# EAGLE design pov_alt (EAGLE 5.11)
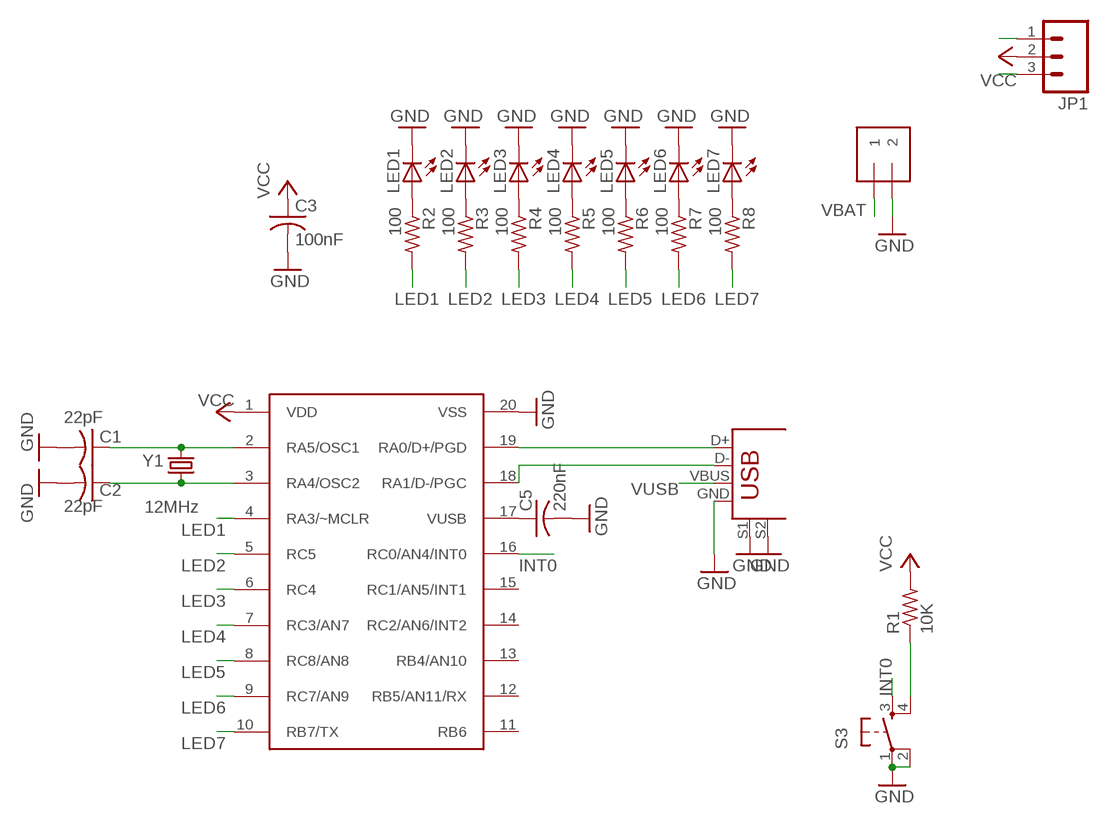
[diagram p0: schematic, sheet 1]

## Parts
C1  22pF  C-US025-025X050  [C025-025X050]
C2  22pF  C-US025-025X050  [C025-025X050]
C3  100nF  C-US025-025X050  [C025-025X050]
C5  220nF  C-US050-030X075  [C050-030X075]
J1  1X2-3.5MM  [1X2-3.5MM]
JP1  M03LOCK_LONGPADS  [1X03_LOCK_LONGPADS]
LED1  LED5MM  [LED5MM]
LED2  LED5MM  [LED5MM]
LED3  LED5MM  [LED5MM]
LED4  LED5MM  [LED5MM]
LED5  LED5MM  [LED5MM]
LED6  LED5MM  [LED5MM]
LED7  LED5MM  [LED5MM]
R1  10K  R-US_0204/7  [0204/7]
R2  100  R-US_0207/2V  [0207/2V]
R3  100  R-US_0207/2V  [0207/2V]
R4  100  R-US_0207/2V  [0207/2V]
R5  100  R-US_0207/2V  [0207/2V]
R6  100  R-US_0207/2V  [0207/2V]
R7  100  R-US_0207/2V  [0207/2V]
R8  100  R-US_0207/2V  [0207/2V]
S3  TAC_SWITCHPTH  [TACTILE-PTH]
U$1  PIC18F14K50  [DIL20]
U$2  USB+SHIELD  [USB-B-PTH]
Y1  12MHz  CRYSTALHC49UV  [HC49U-V]

## Nets
D+: U$1.19(RA0/D+/PGD) U$2.D+
D-: U$1.18(RA1/D-/PGC) U$2.D-
GND: C1.2 C2.2 C3.2 C5.2 J1.2 LED1.K(C) LED2.K(C) LED3.K(C) LED4.K(C) LED5.K(C) LED6.K(C) LED7.K(C) S3.1 S3.2 U$1.20(VSS) U$2.GND U$2.S1 U$2.S2
INT0: S3.3 U$1.16(RC0/AN4/INT0)
LED1: R2.2 U$1.4(RA3/~MCLR)
LED2: R3.2 U$1.5(RC5)
LED3: R4.2 U$1.6(RC4)
LED4: R5.2 U$1.7(RC3/AN7)
LED5: R6.2 U$1.8(RC8/AN8)
LED6: R7.2 U$1.9(RC7/AN9)
LED7: R8.2 U$1.10(RB7/TX)
N$1: C1.1 U$1.2(RA5/OSC1) Y1.2
N$2: C2.1 U$1.3(RA4/OSC2) Y1.1
N$3: C5.1 U$1.17(VUSB)
N$4: LED1.A R2.1
N$5: LED2.A R3.1
N$6: LED3.A R4.1
N$7: LED4.A R5.1
N$8: LED5.A R6.1
N$9: LED6.A R7.1
N$10: LED7.A R8.1
N$11: R1.1 S3.4
VBAT: J1.1 JP1.3
VCC: C3.1 JP1.2 R1.2 U$1.1(VDD)
VUSB: JP1.1 U$2.VBUS
Unconnected: U$1.11(RB6) U$1.12(RB5/AN11/RX) U$1.13(RB4/AN10) U$1.14(RC2/AN6/INT2) U$1.15(RC1/AN5/INT1)

## Library data of the parts
C1-C3 C5 = adafruit:C-US: CAPACITOR, American symbol
J1 = adafruit:1X2: 3.5mm Terminal block http://www.ladyada.net/library/pcb/eaglelibrary.html
JP1 = SparkFun:M03: Header 3 Standard 3-pin 0.1" header. Use with straight break away headers (SKU : PRT-00116), right angle break away headers (PRT-00553), swiss pins (PRT-00743), machine pins (PRT-00117), and female headers (PRT-00115). Molex polarized connector foot print use with SKU : PRT-08232 with associated crimp pins and housings.
LED1-LED7 = adafruit:LED: LED OSRAM: - CHIPLED LG R971, LG N971, LY N971, LG Q971, LY Q971, LO R971, LY R971 LH N974, LH R974 LS Q976, LO Q976, LY Q976 LO Q996 - Hyper CHIPLED LW Q18S LB Q993, LB Q99A, LB R99A - SideLED LS A670, LO A670, LY A670, LG A670, LP A670 LB A673, LV A673, LT A673, LW A673 LH A674 LY A675 LS A676, LA A676, LO A676, LY A676, LW A676 LS A679, LY A679, LG A679 - Hyper Micro SIDELED® LS Y876, LA Y876, LO Y876, LY Y876 LT Y87S - SmartLED LW L88C, LW L88S LB L89C, LB L89S, LG L890 LS L89K, LO L89K, LY L89K LS L896, LA L896, LO L896, LY L896 - TOPLED LS T670, LO T670, LY T670, LG T670, LP T670 LSG T670, LSP T670, LSY T670, LOP T670, LYG T670 LG T671, LOG T671, LSG T671 LB T673, LV T673, LT T673, LW T673 LH T674 LS T676, LA T676, LO T676, LY T676, LB T676, LH T676, LSB T676, LW T676 LB T67C, LV T67C, LT T67C, LS T67K, LO T67K, LY T67K, LW E67C LS E67B, LA E67B, LO E67B, LY E67B, LB E67C, LV E67C, LT E67C LW T67C LS T679, LY T679, LG T679 LS T770, LO T770, LY T770, LG T770, LP T770 LB T773, LV T773, LT T773, LW T773 LH T774 LS E675, LA E675, LY E675, LS T675 LS T776, LA T776, LO T776, LY T776, LB T776 LHGB T686 LT T68C, LB T68C - Hyper Mini TOPLED® LB M676 - Mini TOPLED Santana® LG M470 LS M47K, LO M47K, LY M47K Source: http://www.osram.convergy.de/
R1-R8 = adafruit:R-US_: RESISTOR, American symbol
S3 = SparkFun:TAC_SWITCH: Momentary Switch Button commonly used for reset or general input. Spark Fun Electronics SKU : COM-00097
U$1 = pedrodiogo:PIC18F14K50: Microchip PIC18F14K50 DATASHEET: http://ww1.microchip.com/downloads/en/DeviceDoc/41350E.pdf
U$2 = SparkFun:USB+SHIELD: USB+Shield USB connector with shield pins connectable
Y1 = SparkFun:CRYSTAL: Crystals Various standard crystals. Proven footprints. Spark Fun Electronics SKU : COM-00534

## Board
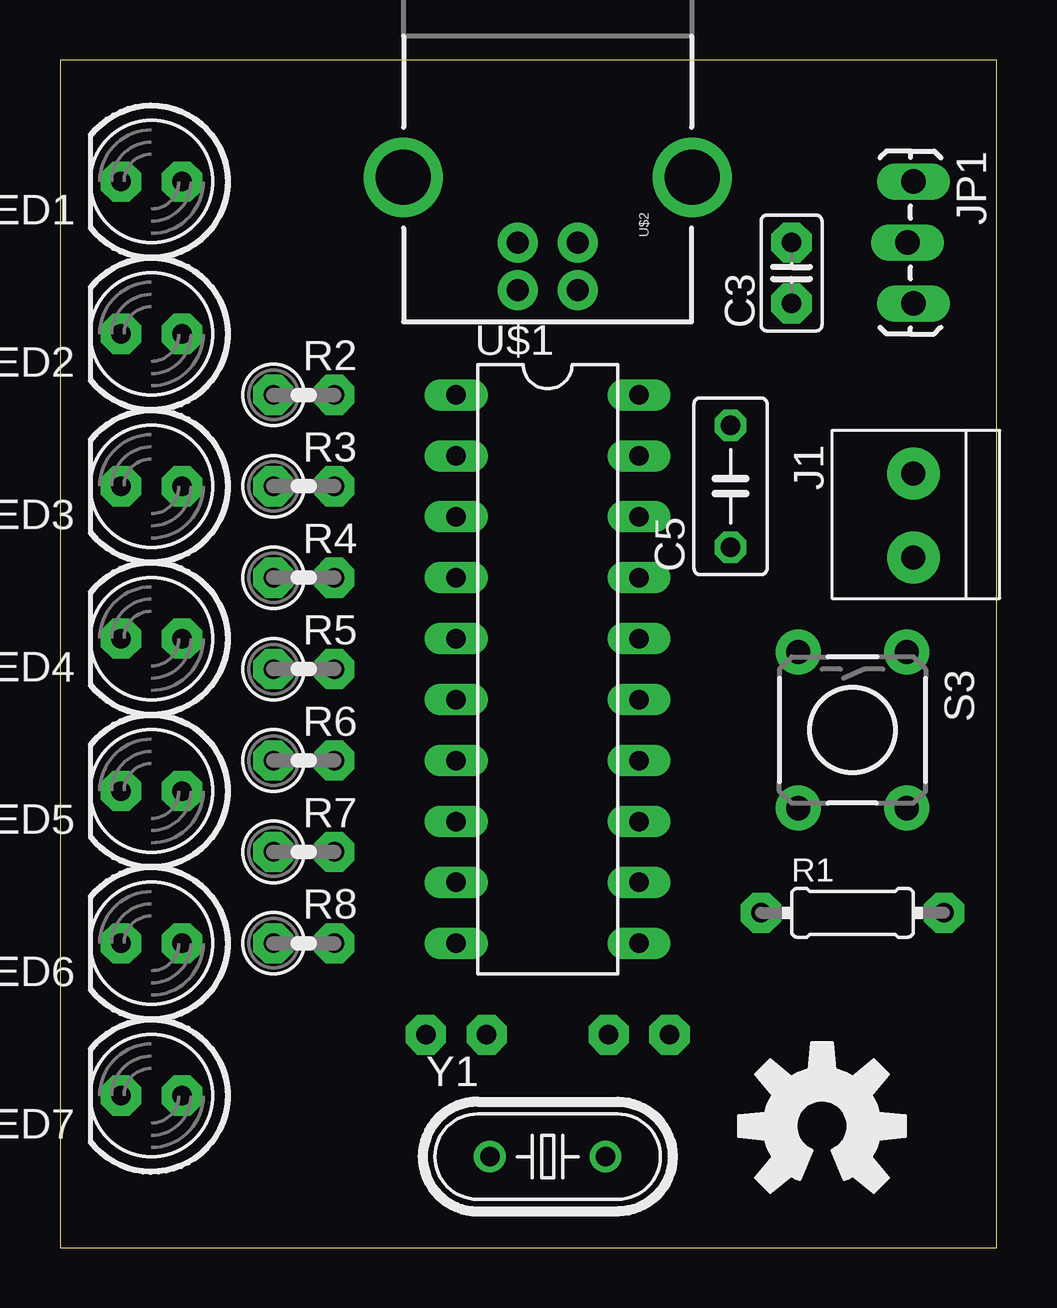
[diagram p1: board, top side]
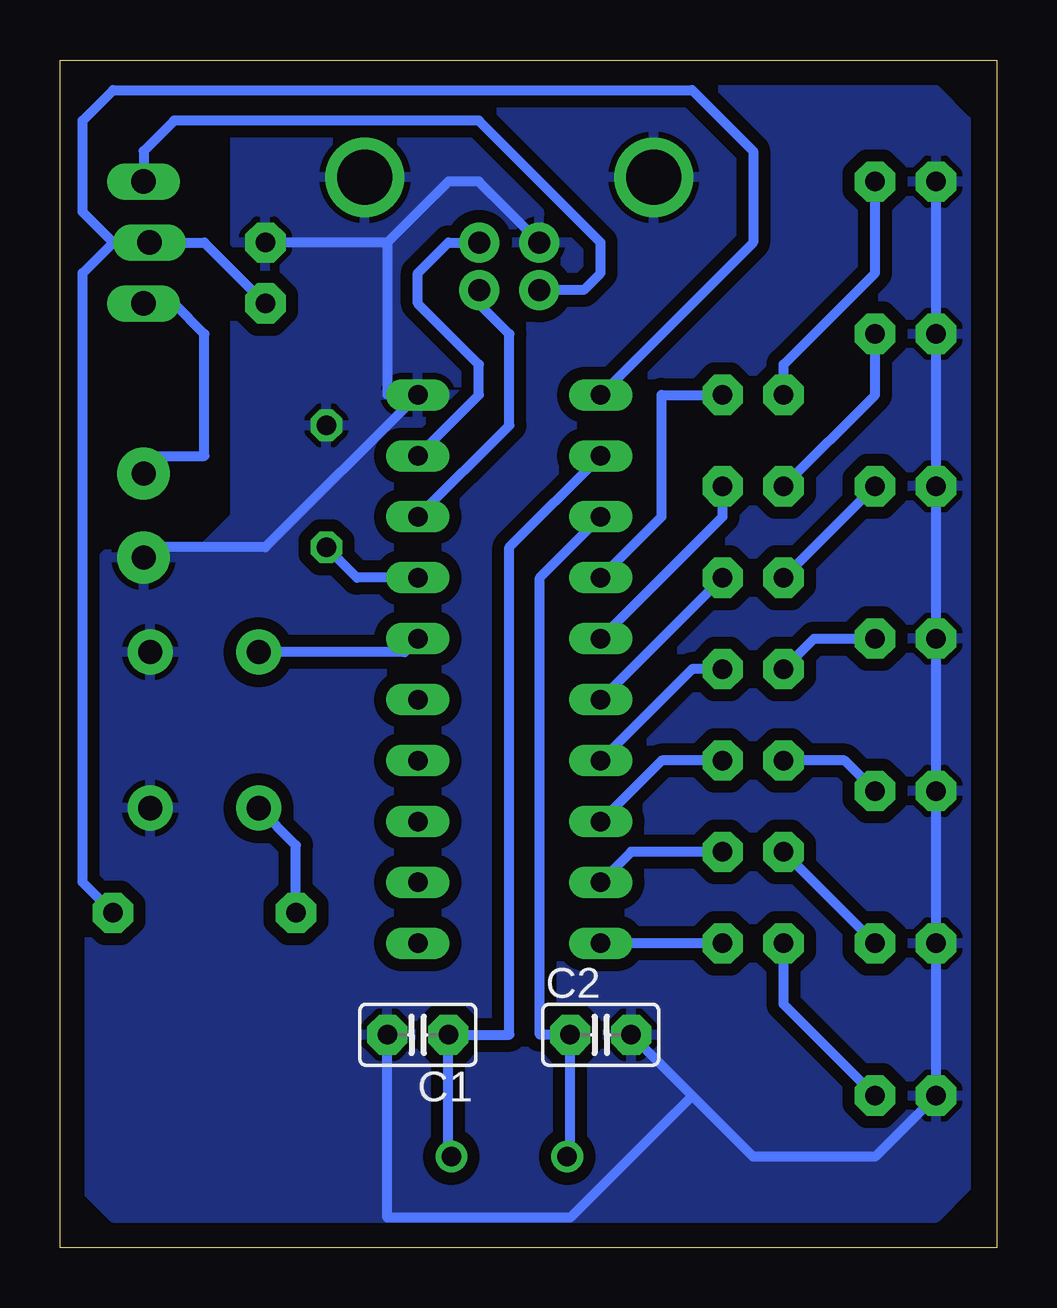
[diagram p2: board, bottom side, seen from below]

Size 39.04 x 49.52 mm. Coordinates in mm from the lower left corner, seen from the top.
Outline: 0,0 39.04,0 39.04,49.52 0,49.52 0,0
Copper layers (1*16): Top 0.035mm / dielectric 1.5mm / Bottom 0.035mm
Design rules "default *": minimum track width 16mil, minimum drill 24mil, track to track 20mil, track to pad 18mil, pad to pad 12mil, via to via 8mil, smd to smd 8mil, copper to edge 40mil, drill to drill 8mil, minimum pad ring 10mil, minimum via ring 8mil, stop-mask expansion 4mil, vias tented up to drill 0mil, thermal gap 10mil

### Footprints (pad centres in the part's own frame; a part is rotated, then mirrored left to right if it is on the bottom)
C025-025X050 = drill 0.813 pad 1.676 octagon: 1 -1.27,0; 2 1.27,0
C050-030X075 = drill 0.813 octagon: 1 -2.54,0; 2 2.54,0
1X2-3.5MM = drill 1 pad 2.184 round: 1 1.8,0; 2 -1.7,0
1X03_LOCK_LONGPADS = drill 1.016 long: 1 0,0; 2 2.54,-0.254; 3 5.08,0
LED5MM = drill 0.813 pad 1.676 octagon: A -1.27,0; K 1.27,0
0204/7 = drill 0.813 pad 1.676 octagon: 1 -3.81,0; 2 3.81,0
0207/2V = drill 0.813 pad 1.676 octagon: 1 -1.27,0; 2 1.27,0
TACTILE-PTH = drill 1.016 pad 1.88 round: 1 -3.251,2.261; 2 3.251,2.261; 3 -3.251,-2.261; 4 3.251,-2.261
DIL20 = drill 0.813 long: 1 -11.43,-3.81; 2 -8.89,-3.81; 3 -6.35,-3.81; 4 -3.81,-3.81; 5 -1.27,-3.81; 6 1.27,-3.81; 7 3.81,-3.81; 8 6.35,-3.81; 9 8.89,-3.81; 10 11.43,-3.81; 11 11.43,3.81; 12 8.89,3.81; 13 6.35,3.81; 14 3.81,3.81; 15 1.27,3.81; 16 -1.27,3.81; 17 -3.81,3.81; 18 -6.35,3.81; 19 -8.89,3.81; 20 -11.43,3.81
USB-B-PTH = drill 0.914 pad 1.676 round: D+ 0,1.25; D- 1.981,1.25; GND 0,-1.25; VBUS 1.981,-1.25 | drill 2.286 round: S1 -2.718,-6.02; S2 -2.718,6.02
HC49U-V = drill 0.813 round: 1 -2.413,0; 2 2.413,0

### Placement (x,y rotation side)
C1  24.13,8.89 180 bottom
C2  16.51,8.89 0 bottom
C3  30.48,40.64 90 top
C5  27.94,31.75 90 top
J1  35.56,30.48 90 top
JP1  35.56,44.45 270 top
LED1  3.81,44.45 180 top
LED2  3.81,38.1 180 top
LED3  3.81,31.75 180 top
LED4  3.81,25.4 180 top
LED5  3.81,19.05 180 top
LED6  3.81,12.7 180 top
LED7  3.81,6.35 180 top
R1  33.02,13.97 0 top
R2  10.16,35.56 0 top
R3  10.16,31.75 0 top
R4  10.16,27.94 0 top
R5  10.16,24.13 0 top
R6  10.16,20.32 0 top
R7  10.16,16.51 0 top
R8  10.16,12.7 0 top
S3  33.02,21.59 270 top
U$1  20.32,24.13 270 top
U$2  20.32,41.91 270 top
U$3  [OSHW-LOGO-L]  31.75,5.08 0 top
Y1  20.32,3.81 0 top

### Tracks (layer width: path | path; a pad name or v marks a point on that pad's centre or on a via)
D+
  Bottom 0.406: U$1.19 21.59,35.56 21.59,36.83 24.13,39.37 24.13,40.64 22.86,41.91 U$2.D+
D-
  Bottom 0.406: U$1.18 20.32,34.29 20.32,38.1 21.59,39.37 21.59,39.91 U$2.D-
GND
  Bottom 0.406: 25.4,41.91 22.86,44.45 21.59,44.45 19.05,41.91 U$2.GND | 25.4,41.91 C3.2 | J1.2 35.56,29.21 30.48,29.21 U$1.20 25.4,35.56 25.4,41.91 | LED1.K LED2.K LED3.K LED4.K LED5.K LED6.K LED7.K 5.08,3.81 10.16,3.81 12.7,6.35 | 12.7,6.35 C2.2 | C1.2 25.4,1.27 17.78,1.27 12.7,6.35
  pour Bottom: 1.27,46.99 2.54,48.26 30.48,48.26 31.75,46.99 31.75,30.48 33.02,29.21 36.83,29.21 38.1,27.94 38.1,2.54 36.83,1.27 2.54,1.27 1.27,2.54
INT0
  Bottom 0.406: S3.3 24.69,24.84 U$1.16
LED1
  Bottom 0.406: U$1.4 13.97,30.48 13.97,35.56 R2.2
LED2
  Bottom 0.406: U$1.5 11.43,30.48 R3.2
LED3
  Bottom 0.406: U$1.6 R4.2
LED4
  Bottom 0.406: U$1.7 12.7,24.13 R5.2
LED5
  Bottom 0.406: U$1.8 13.97,20.32 R6.2
LED6
  Bottom 0.406: U$1.9 15.24,16.51 R7.2
LED7
  Bottom 0.406: R8.2 U$1.10
N$1
  Bottom 0.406: Y1.2 22.86,3.81 C1.1 20.32,8.89 20.32,29.21 U$1.2
N$2
  Bottom 0.406: U$1.3 19.05,27.94 19.05,8.89 C2.1 17.78,3.81 Y1.1
N$3
  Bottom 0.406: C5.1 26.67,27.94 U$1.17
N$4
  Bottom 0.406: LED1.A 5.08,40.64 8.89,36.83 R2.1
N$5
  Bottom 0.406: R3.1 5.08,35.56 LED2.A
N$6
  Bottom 0.406: R4.1 LED3.A
N$7
  Bottom 0.406: R5.1 7.62,25.4 LED4.A
N$8
  Bottom 0.406: LED5.A 6.35,20.32 R6.1
N$9
  Bottom 0.406: LED6.A R7.1
N$10
  Bottom 0.406: LED7.A 8.89,10.16 R8.1
N$11
  Bottom 0.406: R1.1 29.21,16.79 S3.4
VBAT
  Bottom 0.406: J1.1 35.56,33.02 33.02,33.02 33.02,38.1 34.29,39.37 JP1.3
VCC
  Bottom 0.406: C3.1 33.02,41.91 JP1.2 36.83,41.91 | U$1.1 10.16,41.91 10.16,45.72 12.7,48.26 36.83,48.26 38.1,46.99 38.1,43.18 36.83,41.91 | 36.83,41.91 38.1,40.64 38.1,15.24 R1.2
VUSB
  Bottom 0.406: U$2.VBUS 17.22,39.93 16.51,40.64 16.51,41.91 21.59,46.99 34.29,46.99 35.56,45.72 JP1.1